# Altium schematic sheet 0to5V输出模块.SchDoc: 0to5V输出
size A4; Author: GAOYANG; Organization: Altium Limited; Address1: L3, 12a Rodborough Rd; Address2: Frenchs Forest; Address3: NSW; Address4: Australia 2086
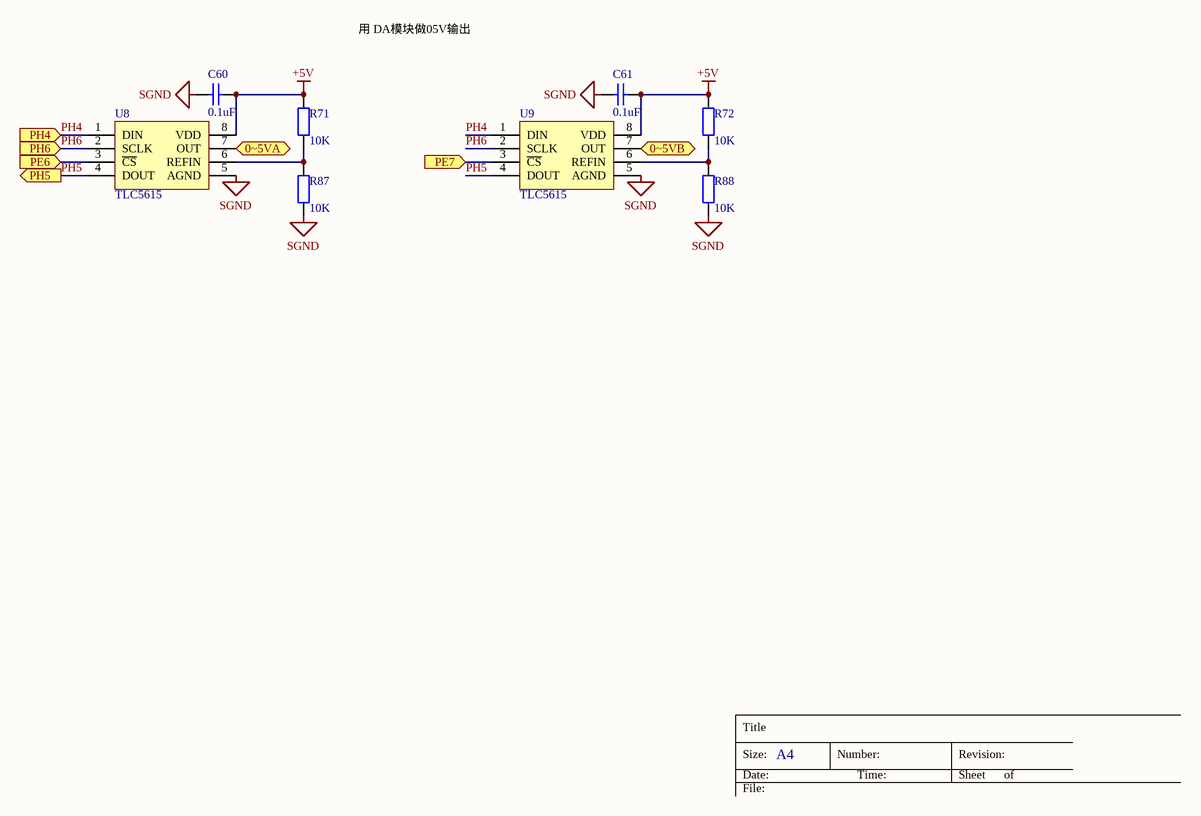
[diagram p0: 0to5V输出模块.SchDoc]

## Parts
C60  value 0.1uF  [0603-L]  (hidden comment: Cap)
C61  value 0.1uF  [0603-L]  (hidden comment: Cap)
R71  value 10K  [0603-L]  (hidden comment: Res2)
R72  value 10K  [0603-L]  (hidden comment: Res2)
R87  value 10K  [0603-L]  (hidden comment: Res2)
R88  value 10K  [0603-L]  (hidden comment: Res2)
U8  TLC5615  [TLC5615]
U9  TLC5615  [TLC5615]

## Ports
0~5VA (out), 0~5VB (out), PE6 (in), PE7 (in), PH4 (in), PH5 (out), PH6 (in)

## Nets
+5V: C60.1 C61.1 R71.2 R72.2 U8.8(VDD) U9.8(VDD)
SGND: C60.2 C61.2 R87.1 R88.1 U8.5(AGND) U9.5(AGND)
0~5VA: U8.7(OUT) ; port 0~5VA
0~5VB: U9.7(OUT) ; port 0~5VB
PE6: U8.3(~{CS}) ; port PE6
PE7: U9.3(~{CS}) ; port PE7
PH4: U8.1(DIN) U9.1(DIN) ; port PH4
PH5: U8.4(DOUT) U9.4(DOUT) ; port PH5
PH6: U8.2(SCLK) U9.2(SCLK) ; port PH6
NetR71_1: R71.1 R87.2 U8.6(REFIN)
NetR72_1: R72.1 R88.2 U9.6(REFIN)

## Notes on the sheet
- 用 DA模块做05V输出
- Title
- Size:
- Date:
- A4
- Number:
- Time:
- Revision:
- Sheet
- of
- File:

## Library data of the parts
C60 C61 = Cap: Capacitor; Published: 8-Jun-2000; LatestRevisionDate: 17-Jul-2002; LatestRevisionNote: Re-released for DXP Platform.; PackageReference: RAD-0.3; Publisher: Altium Limited; PackageDescription: Radial Cap, Thru-Hole; 2 Leads; 0.3 in Pin Spacing
R71 R72 R87 R88 = Res2: Resistor; Published: 8-Jun-2000; LatestRevisionDate: 17-Jul-2002; LatestRevisionNote: Re-released for DXP Platform.; PackageReference: AXIAL-0.4; Publisher: Altium Limited; PackageDescription: Axial Device, Thru-Hole; 2 Leads; 0.4 in Pin Spacing